# EAGLE design injector (EAGLE 6.4)
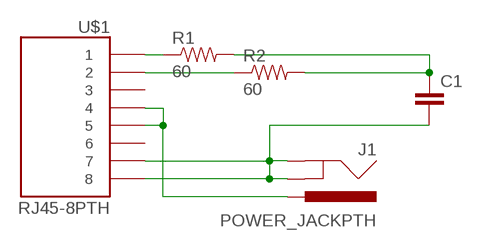
[diagram p0: schematic, sheet 1]

## Parts
C1  CAP0603-CAP  [0603-CAP]
J1  POWER_JACKPTH  [POWER_JACK_PTH]
R1  60  RESISTOR0603-RES  [0603-RES]
R2  60  RESISTOR0603-RES  [0603-RES]
U$1  RJ45-8PTH  [RJ45-8]

## Nets
N$1: R1.1 U$1.1
N$2: R2.1 U$1.2
N$3: J1.PWR U$1.4 U$1.5
N$4: C1.2 J1.GND J1.GNDBREAK U$1.7 U$1.8
N$5: C1.1 R1.2 R2.2
Unconnected: U$1.3 U$1.6

## Library data of the parts
C1 = SparkFun-Capacitors:CAP: Capacitor Standard 0603 ceramic capacitor, and 0.1" leaded capacitor.
J1 = SparkFun-Connectors:POWER_JACK: Power Jack This is the standard 5.5mm barrel jack for power. The PTH is the most common, proven, reliable, footprint. The Slot footprint only works if the mill layer is transmitted to the PCB fab house so be warned. Spark Fun Electronics SKU : PRT-00119 SMT: CONN-08106 Mating wall wart : TOL-00298 (and others)
R1 R2 = SparkFun-Passives:RESISTOR: Resistor Basic schematic elements and footprints for 0603, 1206, and PTH resistors.
U$1 = SparkFun-Connectors:RJ45-8: RJ45 Jack Simple RJ45, 8-pin connection - connector for common Cat5, Cat5e, and Cat6 Ethernet cables. Footprint not yet proven in production. Connector sku is PRT-00643; Breakout PCB sku is BOB-00716.

## Board
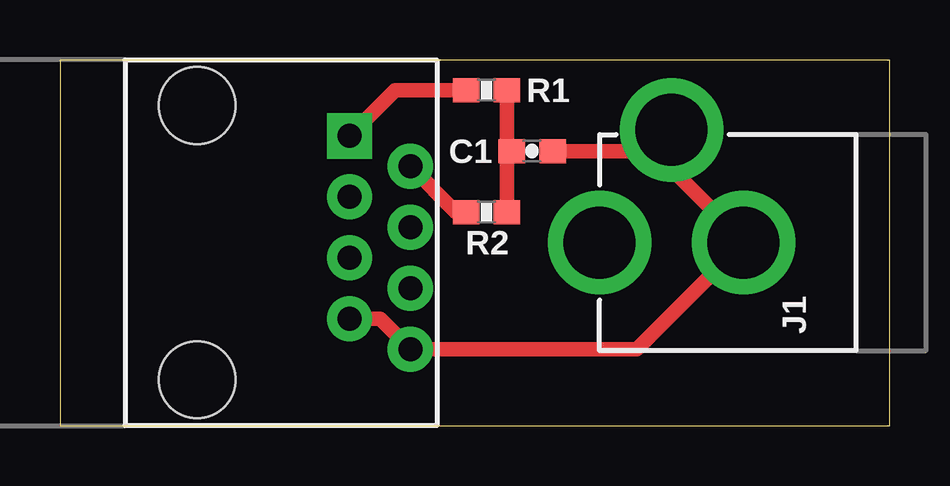
[diagram p1: board, top side]
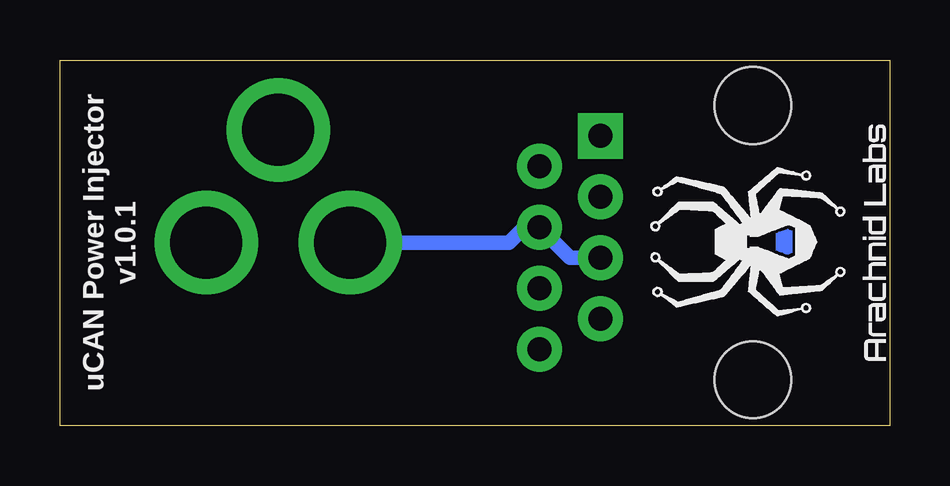
[diagram p2: board, bottom side, seen from below]

Size 34.59 x 15.23 mm. Coordinates in mm from the lower left corner, seen from the top.
Outline: 0,0 34.59,0 34.59,15.23 0,15.23 0,0
Copper layers (1*16): Top 0.035mm / dielectric 1.5mm / Bottom 0.035mm
Design rules "default": minimum track width 10mil, minimum drill 24mil, track to track 8mil, track to pad 8mil, pad to pad 8mil, via to via 8mil, smd to smd 8mil, copper to edge 40mil, drill to drill 8mil, minimum pad ring 10mil, minimum via ring 8mil, stop-mask expansion 4mil, vias tented up to drill 0mil, thermal gap 10mil

### Footprints (pad centres in the part's own frame; a part is rotated, then mirrored left to right if it is on the bottom)
0603-CAP = smd 1.1 x 1: 1 -0.85,0; 2 0.85,0
POWER_JACK_PTH = drill 2.997 pad 4.318: GND 0,7.7; GNDBREAK 4.7,10.7; PWR 0,13.7
0603-RES = smd 1.1 x 1: 1 -0.85,0; 2 0.85,0
RJ45-8 = drill 1 pad 1.88 square: 1 -4.445,6.35 | drill 1 pad 1.88: 2 -3.175,8.89; 3 -1.905,6.35; 4 -0.635,8.89; 5 0.635,6.35; 6 1.905,8.89; 7 3.175,6.35; 8 4.445,8.89 | hole 3.2: -5.715,0; 5.715,0

### Placement (x,y rotation side)
C1  19.68,11.43 0 top
J1  36.2,7.62 90 top
R1  17.78,13.97 0 top
R2  17.78,8.89 0 top
U$1  5.71,7.62 270 top
U$2  [ARACHNID_LABS_LOGO_SM]  5.08,7.62 90 bottom

### Tracks (layer width: path | path; a pad name or v marks a point on that pad's centre or on a via)
N$1
  Top 0.61: R1.1 13.97,13.97 U$1.1
N$2
  Top 0.61: R2.1 16.51,8.89 U$1.2
N$3
  Bottom 0.61: U$1.5 13.34,6.99 U$1.4 15.24,8.26 15.88,7.62 J1.PWR
N$4
  Top 0.61: C1.2 24.61,11.43 24.68,11.51 | 24.68,11.51 J1.GNDBREAK | 24.68,11.51 28.5,7.7 J1.GND 24.05,3.17 U$1.8 13.34,4.45 U$1.7
N$5
  Top 0.61: R1.2 18.63,11.63 C1.1 18.63,11.22 R2.2

### Text on the board
bNames: uCAN Power Injector / v1.0.1